# EAGLE schematic amebot_sensores (EAGLE 6.5.0)
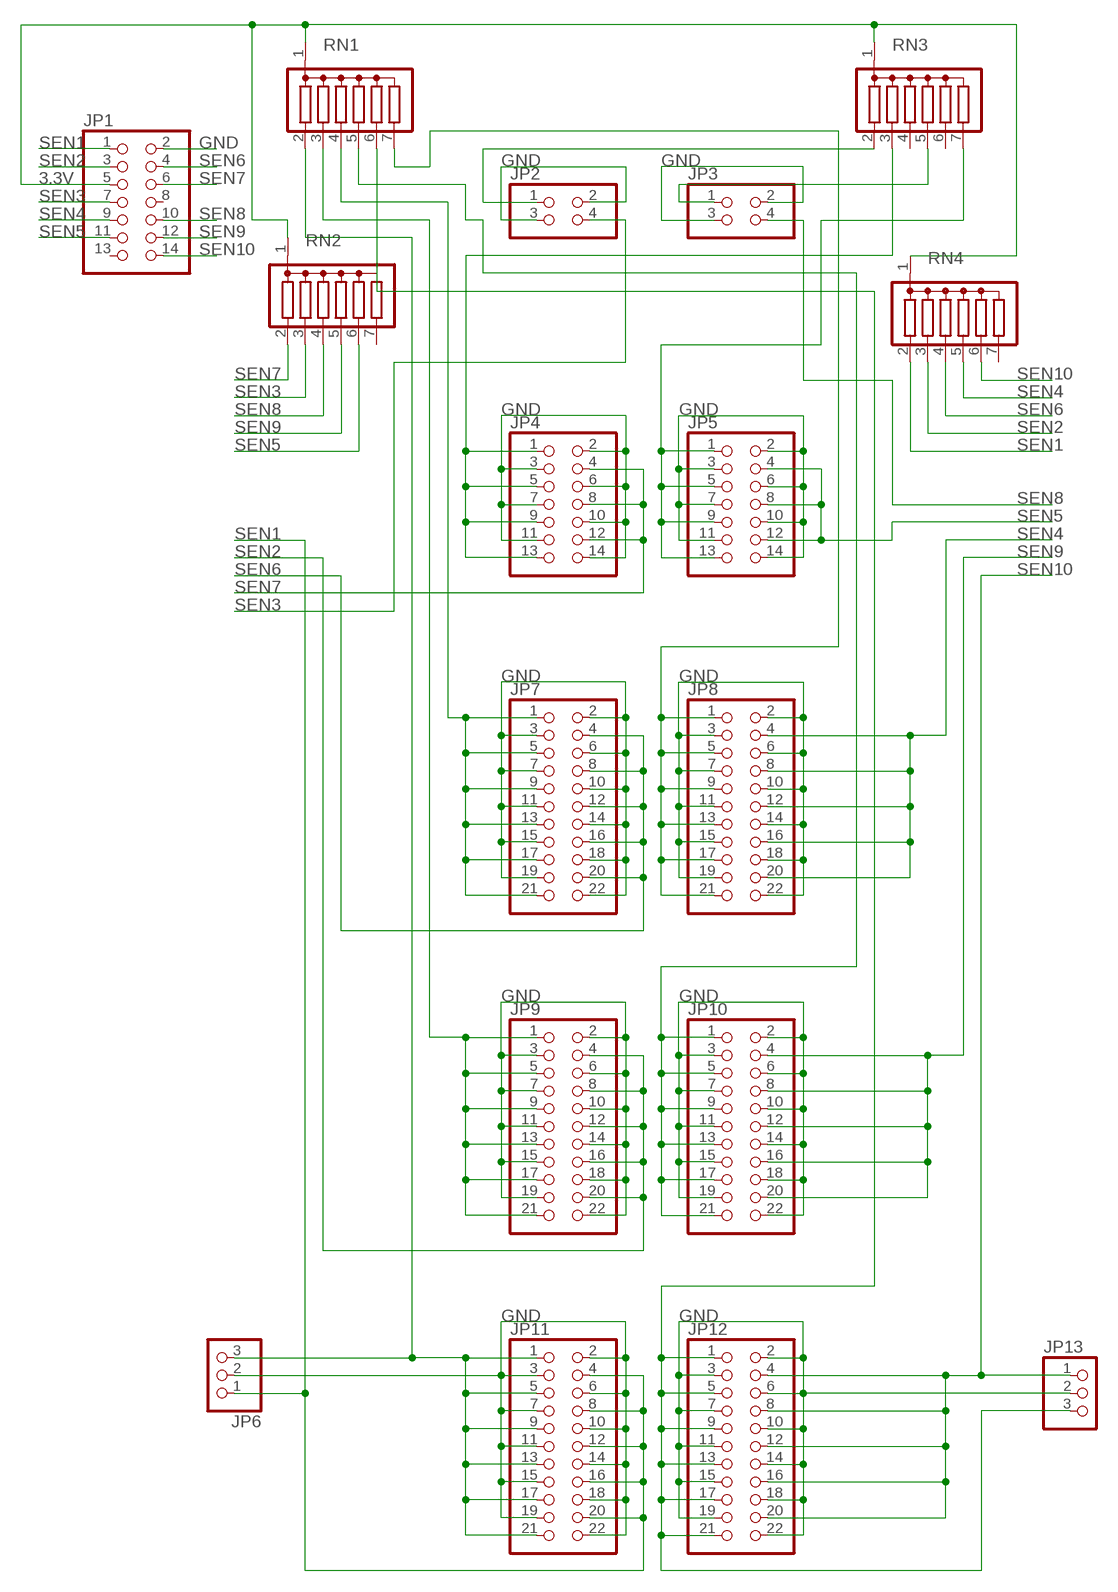
[diagram p0: schematic, sheet 1]

## Parts
JP1  PINHD-2X7  [2X07]
JP2  PINHD-2X2  [2X02]
JP3  PINHD-2X2  [2X02]
JP4  PINHD-2X7  [2X07]
JP5  PINHD-2X7  [2X07]
JP6  PINHD-1X3  [1X03]
JP7  PINHD-2X11  [2X11]
JP8  PINHD-2X11  [2X11]
JP9  PINHD-2X11  [2X11]
JP10  PINHD-2X11  [2X11]
JP11  PINHD-2X11  [2X11]
JP12  PINHD-2X11  [2X11]
JP13  PINHD-1X3  [1X03]
RN1  G06R  [SIL7]
RN2  G06R  [SIL7]
RN3  G06R  [SIL7]
RN4  G06R  [SIL7]

## Nets
3.3V: JP1.5 RN1.1 RN2.1 RN3.1 RN4.1
GND: JP1.2 JP2.2 JP2.3 JP3.2 JP3.3 JP4.2 JP4.3 JP4.6 JP4.7 JP4.10 JP4.11 JP4.14 JP5.2 JP5.3 JP5.6 JP5.7 JP5.10 JP5.11 JP5.14 JP6.2 JP7.2 JP7.3 JP7.6 JP7.7 JP7.10 JP7.11 JP7.14 JP7.15 JP7.18 JP7.19 JP7.22 JP8.2 JP8.3 JP8.6 JP8.7 JP8.10 JP8.11 JP8.14 JP8.15 JP8.18 JP8.19 JP8.22 JP9.2 JP9.3 JP9.6 JP9.7 JP9.10 JP9.11 JP9.14 JP9.15 JP9.18 JP9.19 JP9.22 JP10.2 JP10.3 JP10.6 JP10.7 JP10.10 JP10.11 JP10.14 JP10.15 JP10.18 JP10.19 JP10.22 JP11.2 JP11.3 JP11.6 JP11.7 JP11.10 JP11.11 JP11.14 JP11.15 JP11.18 JP11.19 JP11.22 JP12.2 JP12.3 JP12.6 JP12.7 JP12.10 JP12.11 JP12.14 JP12.15 JP12.18 JP12.19 JP12.22 JP13.2
N$1: JP8.1 JP8.5 JP8.9 JP8.13 JP8.17 JP8.21 RN1.7
N$2: JP2.1 RN3.2
N$3: JP7.1 JP7.5 JP7.9 JP7.13 JP7.17 JP7.21 RN1.4
N$4: JP4.1 JP4.5 JP4.9 JP4.13 RN3.3
N$5: JP5.1 JP5.5 JP5.9 JP5.13 RN3.7
N$6: JP3.1 RN3.5
N$8: JP12.1 JP12.5 JP12.9 JP12.13 JP12.17 JP12.21 JP13.3 RN1.6
N$9: JP6.3 JP11.1 JP11.5 JP11.9 JP11.13 JP11.17 JP11.21 RN1.2
N$10: JP9.1 JP9.5 JP9.9 JP9.13 JP9.17 JP9.21 RN1.3
N$20: JP10.1 JP10.5 JP10.9 JP10.13 JP10.17 JP10.21 RN1.5
SEN1: JP1.1 JP6.1 JP11.4 JP11.8 JP11.12 JP11.16 JP11.20 RN4.2
SEN2: JP1.3 JP9.4 JP9.8 JP9.12 JP9.16 JP9.20 RN4.3
SEN3: JP1.7 JP2.4 RN2.3
SEN4: JP1.9 JP8.4 JP8.8 JP8.12 JP8.16 JP8.20 RN4.5
SEN5: JP1.11 JP5.4 JP5.8 JP5.12 RN2.6
SEN6: JP1.4 JP7.4 JP7.8 JP7.12 JP7.16 JP7.20 RN4.4
SEN7: JP1.6 JP4.4 JP4.8 JP4.12 RN2.2
SEN8: JP1.10 JP3.4 RN2.4
SEN9: JP1.12 JP10.4 JP10.8 JP10.12 JP10.16 JP10.20 RN2.5
SEN10: JP1.14 JP12.4 JP12.8 JP12.12 JP12.16 JP12.20 JP13.1 RN4.6
Unconnected: JP1.8 JP1.13 RN2.7 RN3.4 RN3.6 RN4.7

## Library data of the parts
JP1 JP4 JP5 = pinhead:PINHD-2X7: PIN HEADER
JP2 JP3 = pinhead:PINHD-2X2: PIN HEADER
JP6 JP13 = pinhead:PINHD-1X3: PIN HEADER
JP7-JP12 = pinhead:PINHD-2X11: PIN HEADER
RN1-RN4 = resistor-sil:G06R: SIL RESISTOR; OC_FARNELL: unknown; OC_NEWARK: unknown